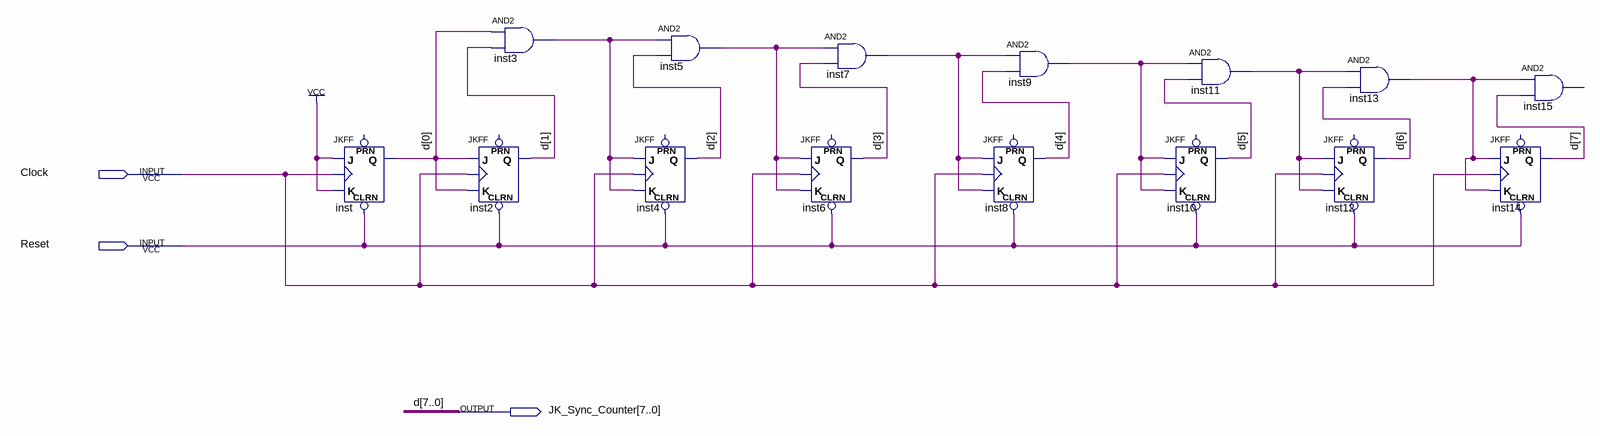
[diagram p0: schematic sheet]
// Quartus schematic JK_Synch_Counter.bdf as structural Verilog: 15 symbols, 3 pins
module JK_Synch_Counter (
  input  Clock,
  input  Reset,
  output [7:0] JK_Sync_Counter
);

  wire inst3_out, inst5_out, inst7_out, inst9_out, inst11_out, inst13_out;

  JKFF inst (.CLRN(Reset), .K(1'b1), .J(1'b1), .CLK(Clock), .Q(JK_Sync_Counter[0]));  // open: PRN
  and inst3 (inst3_out, JK_Sync_Counter[0], JK_Sync_Counter[1]);
  JKFF inst2 (
    .CLRN(Reset), .K(JK_Sync_Counter[0]), .J(JK_Sync_Counter[0]), .CLK(Clock), .Q(JK_Sync_Counter[1]));  // open: PRN
  JKFF inst4 (.CLRN(Reset), .K(inst3_out), .J(inst3_out), .CLK(Clock), .Q(JK_Sync_Counter[2]));  // open: PRN
  and inst5 (inst5_out, inst3_out, JK_Sync_Counter[2]);
  and inst7 (inst7_out, inst5_out, JK_Sync_Counter[3]);
  JKFF inst6 (.CLRN(Reset), .K(inst5_out), .J(inst5_out), .CLK(Clock), .Q(JK_Sync_Counter[3]));  // open: PRN
  and inst9 (inst9_out, inst7_out, JK_Sync_Counter[4]);
  JKFF inst8 (.CLRN(Reset), .K(inst7_out), .J(inst7_out), .CLK(Clock), .Q(JK_Sync_Counter[4]));  // open: PRN
  and inst11 (inst11_out, inst9_out, JK_Sync_Counter[5]);
  JKFF inst10 (.CLRN(Reset), .K(inst9_out), .J(inst9_out), .CLK(Clock), .Q(JK_Sync_Counter[5]));  // open: PRN
  JKFF inst12 (.CLRN(Reset), .K(inst11_out), .J(inst11_out), .CLK(Clock), .Q(JK_Sync_Counter[6]));  // open: PRN
  and inst13 (inst13_out, inst11_out, JK_Sync_Counter[6]);
  // AND2 inst15 has open pins: IN1=inst13_out, IN2=JK_Sync_Counter[7], OUT=open
  JKFF inst14 (.CLRN(Reset), .K(inst13_out), .J(inst13_out), .CLK(Clock), .Q(JK_Sync_Counter[7]));  // open: PRN

  // Other names for the same wires on the sheet: d[7:0] = JK_Sync_Counter
endmodule
